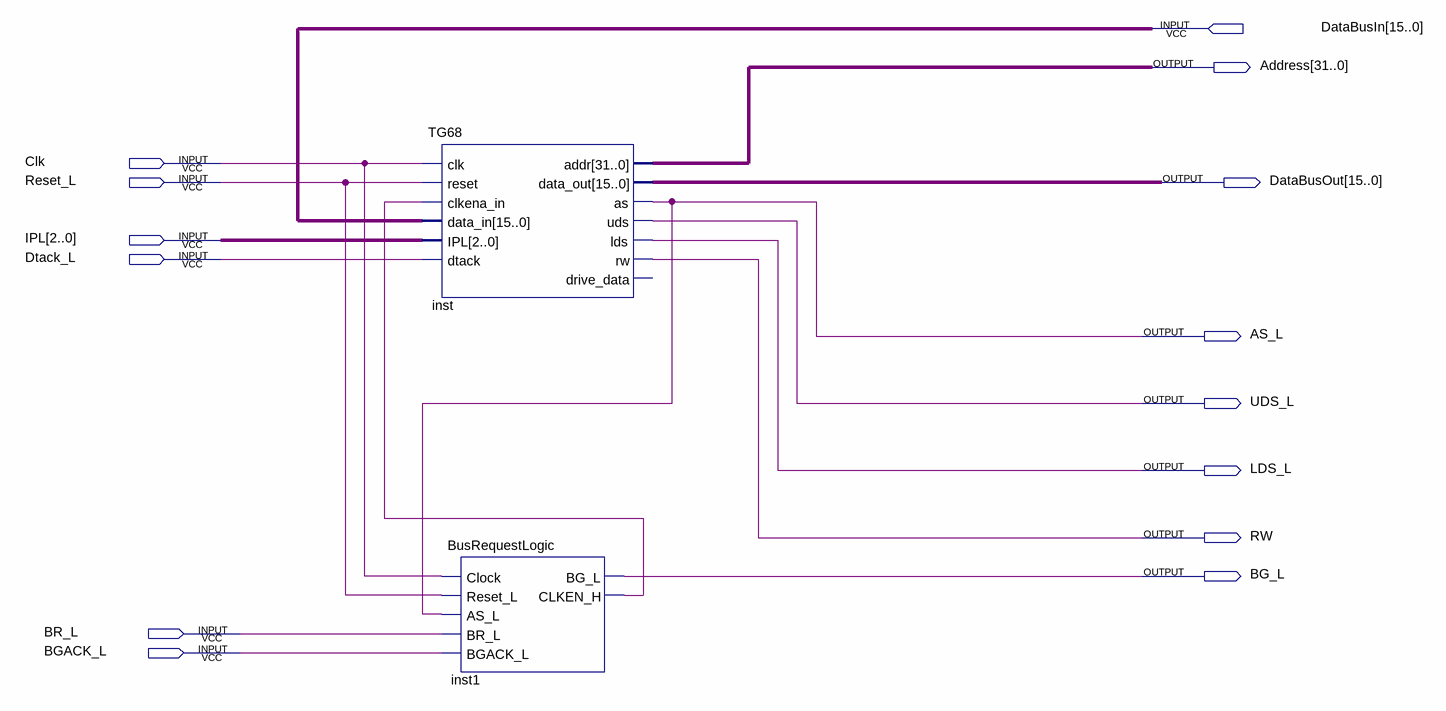
[diagram p0: schematic sheet]
// Quartus schematic M68000CPU.bdf as structural Verilog: 2 symbols, 14 pins
module M68000CPU (
  input  [15:0] DataBusIn,
  input  Clk,
  input  Reset_L,
  input  [2:0] IPL,
  input  Dtack_L,
  input  BR_L,
  input  BGACK_L,
  output [31:0] Address,
  output [15:0] DataBusOut,
  output AS_L,
  output UDS_L,
  output LDS_L,
  output RW,
  output BG_L
);

  wire inst1_clken_h;

  TG68 inst (
    .clk(Clk), .reset(Reset_L), .clkena_in(inst1_clken_h), .data_in(DataBusIn), .IPL(IPL), .dtack(Dtack_L),
    .addr(Address), .data_out(DataBusOut), .as(AS_L), .uds(UDS_L), .lds(LDS_L), .rw(RW));  // open: drive_data
  BusRequestLogic inst1 (
    .Clock(Clk), .Reset_L(Reset_L), .AS_L(AS_L), .BR_L(BR_L), .BGACK_L(BGACK_L), .BG_L(BG_L),
    .CLKEN_H(inst1_clken_h));
endmodule
